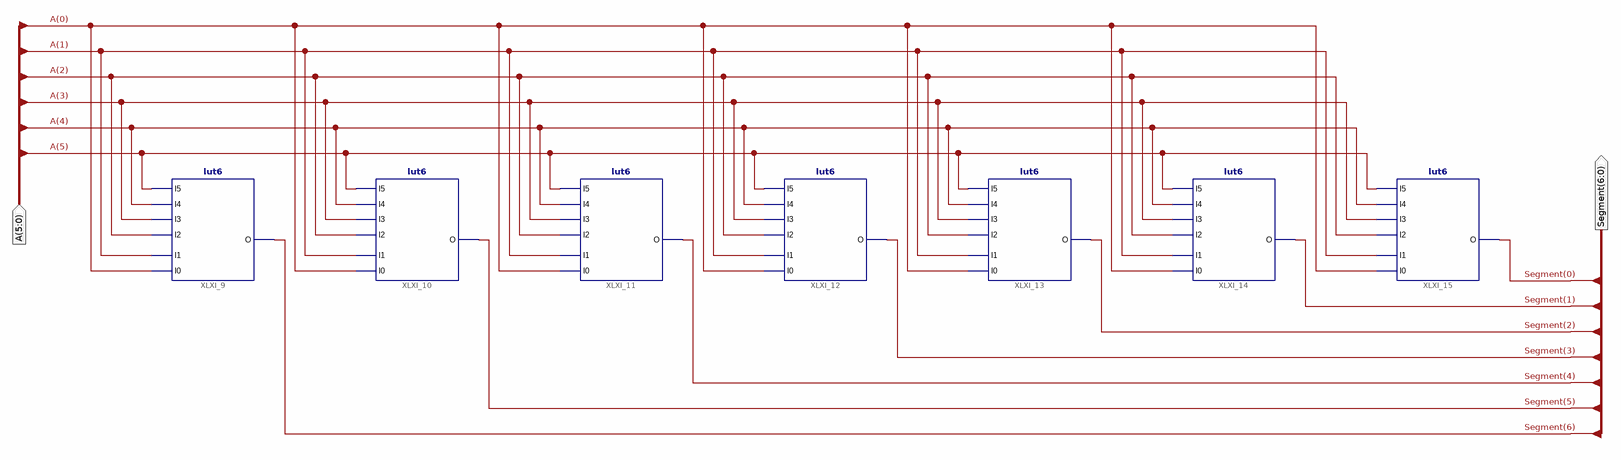
[diagram p0: schematic sheet 1]
// Xilinx ISE schematic ssd1d_0ztb.sch (spartan6) as structural Verilog: 7 symbols, 2 ports
module ssd1d_0ztb (
  input  [5:0] A,
  output [6:0] Segment
);

  lut6 #(.INIT("0000001C6C27DEF8")) XLXI_9 (
    .O(Segment[6]), .I0(A[0]), .I1(A[1]), .I2(A[2]), .I3(A[3]), .I5(A[5]), .I4(A[4]));
  lut6 #(.INIT("0000000AFF67BEE2")) XLXI_10 (
    .O(Segment[5]), .I0(A[0]), .I1(A[1]), .I2(A[2]), .I3(A[3]), .I5(A[5]), .I4(A[4]));
  lut6 #(.INIT("00000011D7E5FA8A")) XLXI_11 (
    .O(Segment[4]), .I0(A[0]), .I1(A[1]), .I2(A[2]), .I3(A[3]), .I5(A[5]), .I4(A[4]));
  lut6 #(.INIT("0000001BE252F6DA")) XLXI_12 (
    .O(Segment[3]), .I0(A[0]), .I1(A[1]), .I2(A[2]), .I3(A[3]), .I5(A[5]), .I4(A[4]));
  lut6 #(.INIT("0000000DAB9E5FF6")) XLXI_13 (
    .O(Segment[2]), .I0(A[0]), .I1(A[1]), .I2(A[2]), .I3(A[3]), .I5(A[5]), .I4(A[4]));
  lut6 #(.INIT("0000001E8F1E4F3E")) XLXI_14 (
    .O(Segment[1]), .I0(A[0]), .I1(A[1]), .I2(A[2]), .I3(A[3]), .I5(A[5]), .I4(A[4]));
  lut6 #(.INIT("000000103F83AFDA")) XLXI_15 (
    .O(Segment[0]), .I0(A[0]), .I1(A[1]), .I2(A[2]), .I3(A[3]), .I5(A[5]), .I4(A[4]));
endmodule
